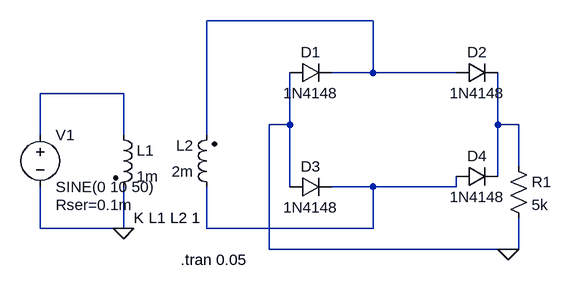
[diagram p0: schematic (1)Full wave rectifier.asc]
(1)Full wave rectifier.asc, the LTspice schematic file:
Version 4
SHEET 1 880 680
WIRE 240 48 -16 48
WIRE 240 128 240 48
WIRE 240 128 176 128
WIRE 368 128 240 128
WIRE -144 160 -272 160
WIRE 112 208 112 128
WIRE 112 208 80 208
WIRE 432 208 432 128
WIRE 464 208 432 208
WIRE -272 224 -272 160
WIRE -144 224 -144 160
WIRE -16 224 -16 48
WIRE 464 272 464 208
WIRE 432 288 432 208
WIRE 112 304 112 208
WIRE 240 304 176 304
WIRE 368 304 368 288
WIRE 368 304 240 304
WIRE -272 368 -272 304
WIRE -144 368 -144 304
WIRE -144 368 -272 368
WIRE -16 368 -16 304
WIRE 240 368 240 304
WIRE 240 368 -16 368
WIRE 80 400 80 208
WIRE 448 400 80 400
WIRE 464 400 464 352
WIRE 464 400 448 400
FLAG 448 400 0
FLAG -144 368 0
SYMBOL diode 112 144 R270
WINDOW 0 32 32 VTop 2
WINDOW 3 0 32 VBottom 2
SYMATTR InstName D1
SYMATTR Value 1N4148
SYMBOL diode 368 144 R270
WINDOW 0 32 32 VTop 2
WINDOW 3 0 32 VBottom 2
SYMATTR InstName D2
SYMATTR Value 1N4148
SYMBOL diode 112 320 R270
WINDOW 0 32 32 VTop 2
WINDOW 3 0 32 VBottom 2
SYMATTR InstName D3
SYMATTR Value 1N4148
SYMBOL diode 368 304 R270
WINDOW 0 32 32 VTop 2
WINDOW 3 0 32 VBottom 2
SYMATTR InstName D4
SYMATTR Value 1N4148
SYMBOL ind2 -160 208 R0
SYMATTR InstName L1
SYMATTR Value 1m
SYMATTR Type ind
SYMBOL ind2 0 320 R180
WINDOW 0 36 80 Left 2
WINDOW 3 36 40 Left 2
SYMATTR InstName L2
SYMATTR Value 2m
SYMATTR Type ind
SYMBOL voltage -272 208 R0
WINDOW 123 0 0 Left 0
WINDOW 39 24 124 Left 2
SYMATTR InstName V1
SYMATTR Value SINE(0 10 50)
SYMATTR SpiceLine Rser=0.1m
SYMBOL res 448 256 R0
SYMATTR InstName R1
SYMATTR Value 5k
TEXT -128 352 Left 2 !K L1 L2 1
TEXT -56 416 Left 2 !.tran 0.05

The netlist it stands for:
* (1)Full wave rectifier.asc
D1 0 N001 1N4148
D2 N001 N003 1N4148
D3 0 N004 1N4148
D4 N004 N003 1N4148
L1 N002 0 1m
L2 N004 N001 2m
V1 N002 0 SINE(0 10 50) Rser=0.1m
R1 N003 0 5k
.model D D
.lib standard.dio
K L1 L2 1
.tran 0.05
.backanno
.end